# EAGLE design SwitchBypass (EAGLE 9.6.2)
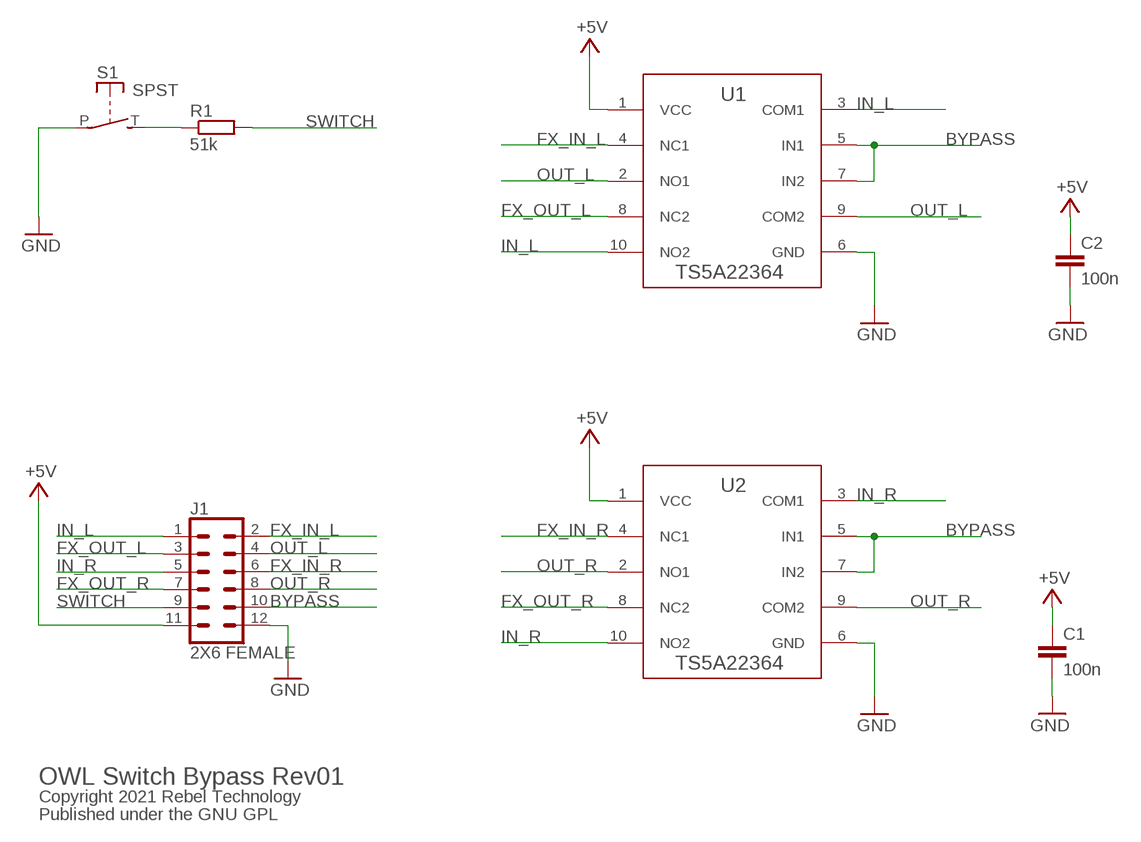
[diagram p0: schematic, sheet 1]

## Parts
C1  100n  C-EUC0603  [C0603]
C2  100n  C-EUC0603  [C0603]
J1  2X6 FEMALE  CONN_06X2PTH_FEMALE  [2X6]
R1  51k  R-EU_0603  [0603]
S1  SPST  [JUDCOSPST]
U1  TS5A22364  TS5A22364DGSRDGS0010A_L  [DGS0010A_L]
U2  TS5A22364  TS5A22364DGSRDGS0010A_L  [DGS0010A_L]

## Nets
+5V: C1.1 C2.1 J1.11 U1.1(VCC) U2.1(VCC)
BYPASS: J1.10 U1.5(IN1) U1.7(IN2) U2.5(IN1) U2.7(IN2)
FX_IN_L: J1.2 U1.4(NC1)
FX_IN_R: J1.6 U2.4(NC1)
FX_OUT_L: J1.3 U1.8(NC2)
FX_OUT_R: J1.7 U2.8(NC2)
GND: C1.2 C2.2 J1.12 S1.P U1.6(GND) U2.6(GND)
IN_L: J1.1 U1.3(COM1) U1.10(NO2)
IN_R: J1.5 U2.3(COM1) U2.10(NO2)
N$3: R1.1 S1.T(S)
OUT_L: J1.4 U1.2(NO1) U1.9(COM2)
OUT_R: J1.8 U2.2(NO1) U2.9(COM2)
SWITCH: J1.9 R1.2

## Notes on the sheet
- OWL Switch Bypass Rev01
- Copyright 2021 Rebel Technology
- Published under the GNU GPL

## Library data of the parts
C1 C2 = Rebel:C-EU: CAPACITOR, European symbol
J1 = SparkFun-Connectors:CONN_06X2: Multi connection point. Often used as Generic Header-pin footprint for 0.1 inch spaced/style header connections On any of the 0.1 inch spaced packages, you can populate with these: Break Away Headers - Straight <https://www.sparkfun.com/products/116> (PRT-00116) Break Away Male Headers - Right Angle <https://www.sparkfun.com/products/553> (PRT-00553) Female Headers <https://www.sparkfun.com/products/115> (PRT-00115) Break Away Headers - Machine Pin <https://www.sparkfun.com/products/117> (PRT-00117) Break Away Female Headers - Swiss Machine Pin <https://www.sparkfun.com/products/743> (PRT-00743); PROD_ID: CONN-12423
R1 = Rebel:R-EU_: RESISTOR, European symbol
S1 = adafruit:SPST: Judco 50-0015-00
U1 U2 = Rebel:TS5A22364DGSR; APPLICATION_BUILDNUMBER: *; COMPTYPE: IC; MANUFACTURER: Texas Instruments; MOUNTTYPE: SMT; PACKAGEREFERENCE: DGS0010A; PARTNUMBER: TS5A22364DGSR; PIN_COUNT: 10; REFDES: RefDes; ROHS: Y; TYPE: TYPE; VALUE: Value

## Board
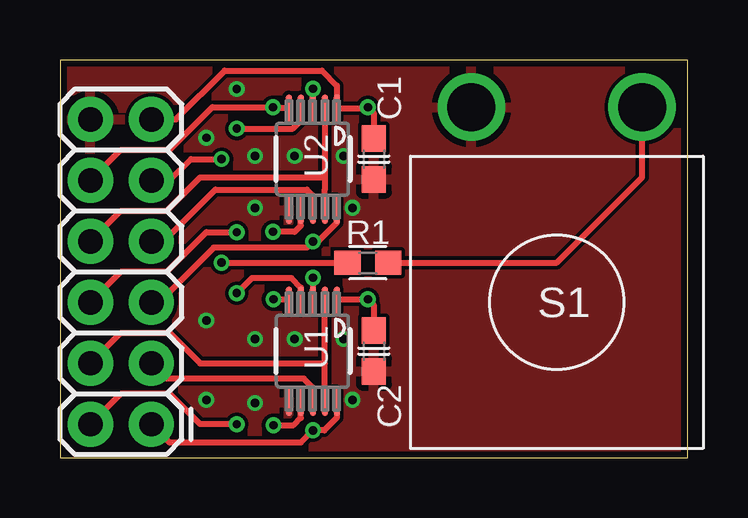
[diagram p1: board, top side]
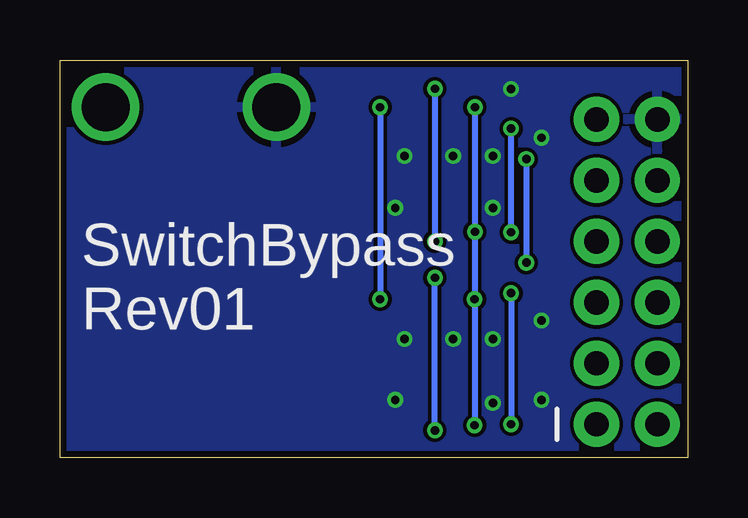
[diagram p2: board, bottom side, seen from below]

Size 26.16 x 16.57 mm. Coordinates in mm from the lower left corner, seen from the top.
Outline: 0,0 26.16,0 26.16,16.57 0,16.57 0,0
Copper layers (1*16): Top 0.035mm / dielectric 1.5mm / Bottom 0.035mm
Design rules "Rebel *": minimum track width 6mil, minimum drill 12mil, track to track 6mil, track to pad 6mil, pad to pad 6mil, via to via 6mil, smd to smd 0mil, copper to edge 10mil, drill to drill 10mil, minimum pad ring 10mil, minimum via ring 6mil, stop-mask expansion 2mil, vias tented up to drill 100mil, thermal gap 10mil

### Footprints (pad centres in the part's own frame; a part is rotated, then mirrored left to right if it is on the bottom)
C0603 = smd 1.1 x 1: 1 -0.85,0; 2 0.85,0
2X6 = drill 1.016 pad 1.88: 1 0,0; 2 0,2.54; 3 2.54,0; 4 2.54,2.54; 5 5.08,0; 6 5.08,2.54; 7 7.62,0; 8 7.62,2.54; 9 10.16,0; 10 10.16,2.54; 11 12.7,0; 12 12.7,2.54
0603 = smd 1.1 x 1: 1 -0.85,0; 2 0.85,0
JUDCOSPST = drill 2: P 3.556,-8.128; T -3.556,-8.128
DGS0010A_L = smd 1.15 x 0.25: 1 -2.125,1; 2 -2.125,0.5; 3 -2.125,0; 4 -2.125,-0.5; 5 -2.125,-1; 6 2.125,-1; 7 2.125,-0.5; 8 2.125,0; 9 2.125,0.5; 10 2.125,1

### Placement (x,y rotation side)
C1  13.08,12.45 270 top
C2  13.08,4.45 270 top
J1  3.81,1.4 90 top
R1  12.83,8.13 180 top
S1  20.7,6.48 180 top
U1  10.54,4.45 270 top
U2  10.54,12.45 270 top

### Tracks (layer width: path | path; a pad name or v marks a point on that pad's centre or on a via)
+5V  (via drill 0.35)
  Top 0.254: J1.11 4.83,14.1 6.86,16.13 10.92,16.13 11.54,15.51 U2.1 12.79,14.57 v12.83,14.6 13.08,14.35 C1.1 | C2.1 13.08,6.35 v12.83,6.6 11.58,6.6 U1.1
  Bottom 0.254: v12.83,14.6 v12.83,6.6
BYPASS  (via drill 0.35)
  Top 0.254: J1.10 2.54,12.83 4.57,12.83 6.35,14.6 v8.87,14.6 8.91,14.57 U2.5 | U2.7 10.04,9.67 9.78,9.41 v8.88,9.41 v8.87,9.42 | v8.89,6.6 9.51,6.6 U1.5 | U1.7 10.04,1.66 9.74,1.36 v8.89,1.36
  Bottom 0.254: v8.87,14.6 v8.87,9.42 8.87,6.62 v8.89,6.6 v8.89,1.36
FX_IN_L  (via drill 0.35)
  Top 0.254: J1.2 2.54,2.67 4.57,2.67 5.84,1.4 v7.37,1.4 | v7.37,6.86 8,7.49 9.64,7.49 10.04,7.09 U1.4
  Bottom 0.254: v7.37,6.86 v7.37,1.4
FX_IN_R  (via drill 0.35)
  Top 0.254: J1.6 2.54,7.75 4.45,7.75 6.1,9.4 v7.37,9.4 | U2.4 10.04,14.05 9.71,13.72 v7.37,13.72
  Bottom 0.254: v7.37,9.4 v7.37,13.72
FX_OUT_L
  Top 0.254: J1.3 4.45,3.3 10.16,3.3 10.54,2.92 U1.8
FX_OUT_R
  Top 0.254: J1.7 4.32,9.02 6.48,11.18 10.29,11.18 10.54,10.92 U2.8
GND  (via drill 0.35)
  other vias: 8.13,10.41 9.78,12.57 9.78,4.95 8.13,2.29 12.19,2.41 12.19,10.41 8.13,4.95 8.13,12.57 11.81,12.57 11.81,4.95 6.1,13.34 6.1,5.71 6.1,2.41 7.37,15.37
  pour Top: -1.27,17.91 35.56,17.91 35.56,-1.14 -1.27,-1.14
  pour Bottom: 0,17.91 36.83,17.91 36.83,-1.14 0,-1.14
IN_L  (via drill 0.35)
  Top 0.254: J1.1 4.57,0.63 10.03,0.63 v10.54,1.14 11.01,1.14 11.54,1.67 U1.10 | v10.54,7.5 U1.3
  Bottom 0.254: v10.54,1.14 v10.54,7.5
IN_R  (via drill 0.35)
  Top 0.254: U2.3 v10.54,15.38 | U2.10 11.54,9.8 10.75,9.01 v10.54,9.01 10.29,8.76 6.4,8.76 4.15,6.5 3.84,6.5 J1.5
  Bottom 0.254: v10.54,15.38 v10.54,9.01
N$3
  Top 0.254: R1.1 20.7,8.13 24.26,11.68 S1.T
OUT_L
  Top 0.254: J1.4 2.54,5.21 4.57,5.21 5.84,3.94 11.04,3.94 | U1.9 11.04,3.94 | 11.04,3.94 U1.2
OUT_R
  Top 0.254: J1.8 2.54,10.29 4.45,10.29 5.84,11.68 11.04,11.68 | U2.2 11.04,11.68 | 11.04,11.68 11.04,11.18 U2.9
SWITCH  (via drill 0.35)
  Top 0.254: J1.9 4.57,11.56 5.46,12.45 v6.73,12.45 | v6.73,8.13 R1.2
  Bottom 0.254: v6.73,12.45 v6.73,8.13

### Text on the board
bPlace: SwitchBypass / Rev01